# Altium project sion.PrjPcb
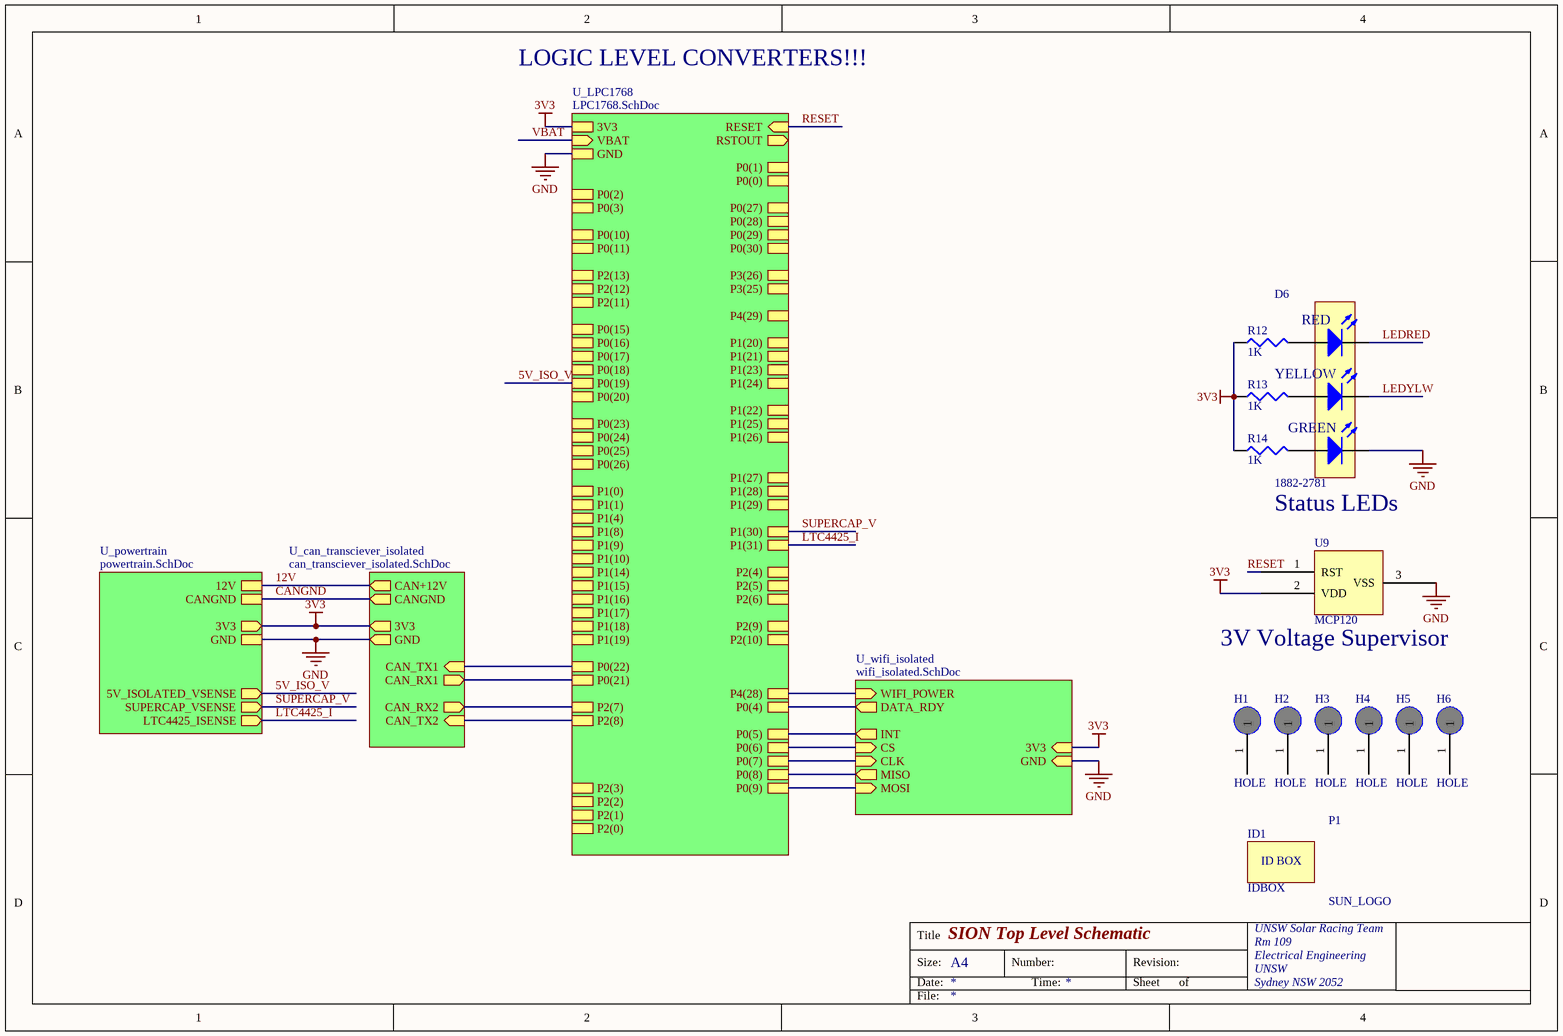
[diagram p0: toplevel.SchDoc]
8 sheets, 172 parts. Net scope: hierarchical (ports join the sheet entries above them; power ports are global).
Board file: sion.PcbDoc
Sheets:
  toplevel.SchDoc
    U_powertrain = powertrain.SchDoc
      U_supercap = supercap.SchDoc
      U_sepic = sepic.SchDoc
    U_can_transciever_isolated = can_transciever_isolated.SchDoc
    U_LPC1768 = LPC1768.SchDoc
  wifi_isolated_uart.SchDoc
  USB_Serial_Isolated.SchDoc

## Sheet toplevel.SchDoc: SION Top Level Schematic
size A4; Organization: UNSW Solar Racing Team; Address3: UNSW; Address4: Sydney NSW 2052; Address2: Electrical Engineering; Address1: Rm 109

### Parts
(Parts that share a designator on the sheet are numbered #1, #2 ... from top to bottom, then left to right.)
D6#1  1882-2781  [LED_TRILEVEL]
H1  HOLE  [#6]
H2  HOLE  [#6]
H3  HOLE  [#6]
H4  HOLE  [#6]
H5  HOLE  [#6]
H6  HOLE  [#6]
ID1  IDBOX  [IDBOX]
P1  SUN_LOGO  [SUNSWIFTLOGO]
R12#1  1K  [0603]
R13#1  1K  [0603]
R14#1  1K  [0603]
U9  MCP120  [SOT23-3]

### Sub-sheets
U_can_transciever_isolated = can_transciever_isolated.SchDoc: CAN+12V (out), CAN_TX1 (in), CAN_TX2 (in), CAN_RX1 (out), CAN_RX2 (out), CANGND (out), GND (out), 3V3 (out)
U_LPC1768 = LPC1768.SchDoc: P0(26), P0(25), P0(24), P0(23), P1(31), P1(30), P0(28), P0(27), P3(26), P3(25), P0(29), P0(30), P1(18), P1(19), P1(20), P1(21), P1(22), P1(24), P1(23), P1(25), P1(26), P1(27), P1(28), P1(29), P0(0), P0(1), P0(10), P0(11), P2(13), P2(12), P2(11), P2(10), P0(22), P0(21), P0(20), P0(19), P0(18), P0(17), P0(15), P0(16), P2(9), P2(8), P2(7), P2(6), P2(5), P2(4), P2(3), P2(2), P2(1), P2(0), P0(2), P0(3), P1(0), P1(1), P1(4), P1(8), P1(9), P1(10), P1(14), P1(15), P1(16), P1(17), P0(4), P0(5), P0(6), P0(7), P0(8), P0(9), P4(29), P4(28), GND, 3V3, RSTOUT (out), RESET (in), VBAT (in)
U_powertrain = powertrain.SchDoc: GND, 5V_ISOLATED_VSENSE (out), SUPERCAP_VSENSE (out), 12V, CANGND, 3V3 (out), LTC4425_ISENSE (out)
U_wifi_isolated = wifi_isolated.SchDoc (file not in this document): CS (in), CLK (in), MISO (out), MOSI (in), INT (out), GND (in), 3V3 (in), WIFI_POWER (in), DATA_RDY (out)

### Nets
3V3: R12#1.1 R13#1.1 R14#1.1 U9.2(VDD) ; sheet U_powertrain/3V3, sheet U_can_transciever_isolated/3V3, sheet U_LPC1768/3V3, sheet U_wifi_isolated/3V3  [project net VDDA]
12V: sheet U_powertrain/12V, sheet U_can_transciever_isolated/CAN+12V
CANGND: sheet U_powertrain/CANGND, sheet U_can_transciever_isolated/CANGND
GND: D6#1.1(K) U9.3(VSS) ; sheet U_powertrain/GND, sheet U_can_transciever_isolated/GND, sheet U_LPC1768/GND, sheet U_wifi_isolated/GND  [project net VREFN]
5V_ISO_V: sheet U_powertrain/5V_ISOLATED_VSENSE, sheet U_LPC1768/P0(19)
LEDRED: D6#1.3(K)
LEDYLW: D6#1.2(K)
LTC4425_I: sheet U_powertrain/LTC4425_ISENSE, sheet U_LPC1768/P1(31)
RESET: U9.1(RST) ; sheet U_LPC1768/RESET
SUPERCAP_V: sheet U_powertrain/SUPERCAP_VSENSE, sheet U_LPC1768/P1(30)
NetD6#1_4: D6#1.4(A) R12#1.2
NetD6#1_5: D6#1.5(A) R13#1.2
NetD6#1_6: D6#1.6(A) R14#1.2
NetTP1_0: sheet U_can_transciever_isolated/CAN_RX1, sheet U_LPC1768/P0(21)
NetTP2_0: sheet U_can_transciever_isolated/CAN_RX2, sheet U_LPC1768/P2(7)
NetTP3_0: sheet U_can_transciever_isolated/CAN_TX1, sheet U_LPC1768/P0(22)
NetTP4_0: sheet U_can_transciever_isolated/CAN_TX2, sheet U_LPC1768/P2(8)
NetU10_76: sheet U_LPC1768/P0(9), sheet U_wifi_isolated/MOSI
NetU10_77: sheet U_LPC1768/P0(8), sheet U_wifi_isolated/MISO
NetU10_78: sheet U_LPC1768/P0(7), sheet U_wifi_isolated/CLK
NetU10_79: sheet U_LPC1768/P0(6), sheet U_wifi_isolated/CS
NetU10_80: sheet U_LPC1768/P0(5), sheet U_wifi_isolated/INT
NetU10_81: sheet U_LPC1768/P0(4), sheet U_wifi_isolated/DATA_RDY
NetU10_82: sheet U_LPC1768/P4(28), sheet U_wifi_isolated/WIFI_POWER

Not connected (* = marked no-connect by the designer): H1 1; H2 1; H3 1; H4 1; H5 1; H6 1

### Notes on the sheet
- LOGIC LEVEL CONVERTERS!!!
- Status LEDs
- (near U9) 3V Voltage Supervisor
- Title
- Size:
- Date:
- A4
- Number:
- Time:
- Revision:
- Sheet
- of
- File:
- (in symbol IDBOX) ID BOX
- (in symbol LED-TRILEVEL) RED; YELLOW; GREEN

### Library data of the parts
D6#1 = LED-TRILEVEL: Three level LED; Farnell: 1461596
H1-H6 = HOLE: Order#: NA; Supplier: NA; Price: NA
R12#1 R13#1 R14#1 = RES1: Resistor; Order#: 9331697; Supplier: Farnell; Price: 0.05
U9 = MCP120T: Voltage Supervisor; Farnell: 1292233; FarnellPrice: 0.951

## Sheet powertrain.SchDoc: SION Power Train
size A4; Organization: UNSW Solar Racing Team; Address3: UNSW; Address4: Sydney NSW 2052; Address2: Electrical Engineering; Address1: Rm 342
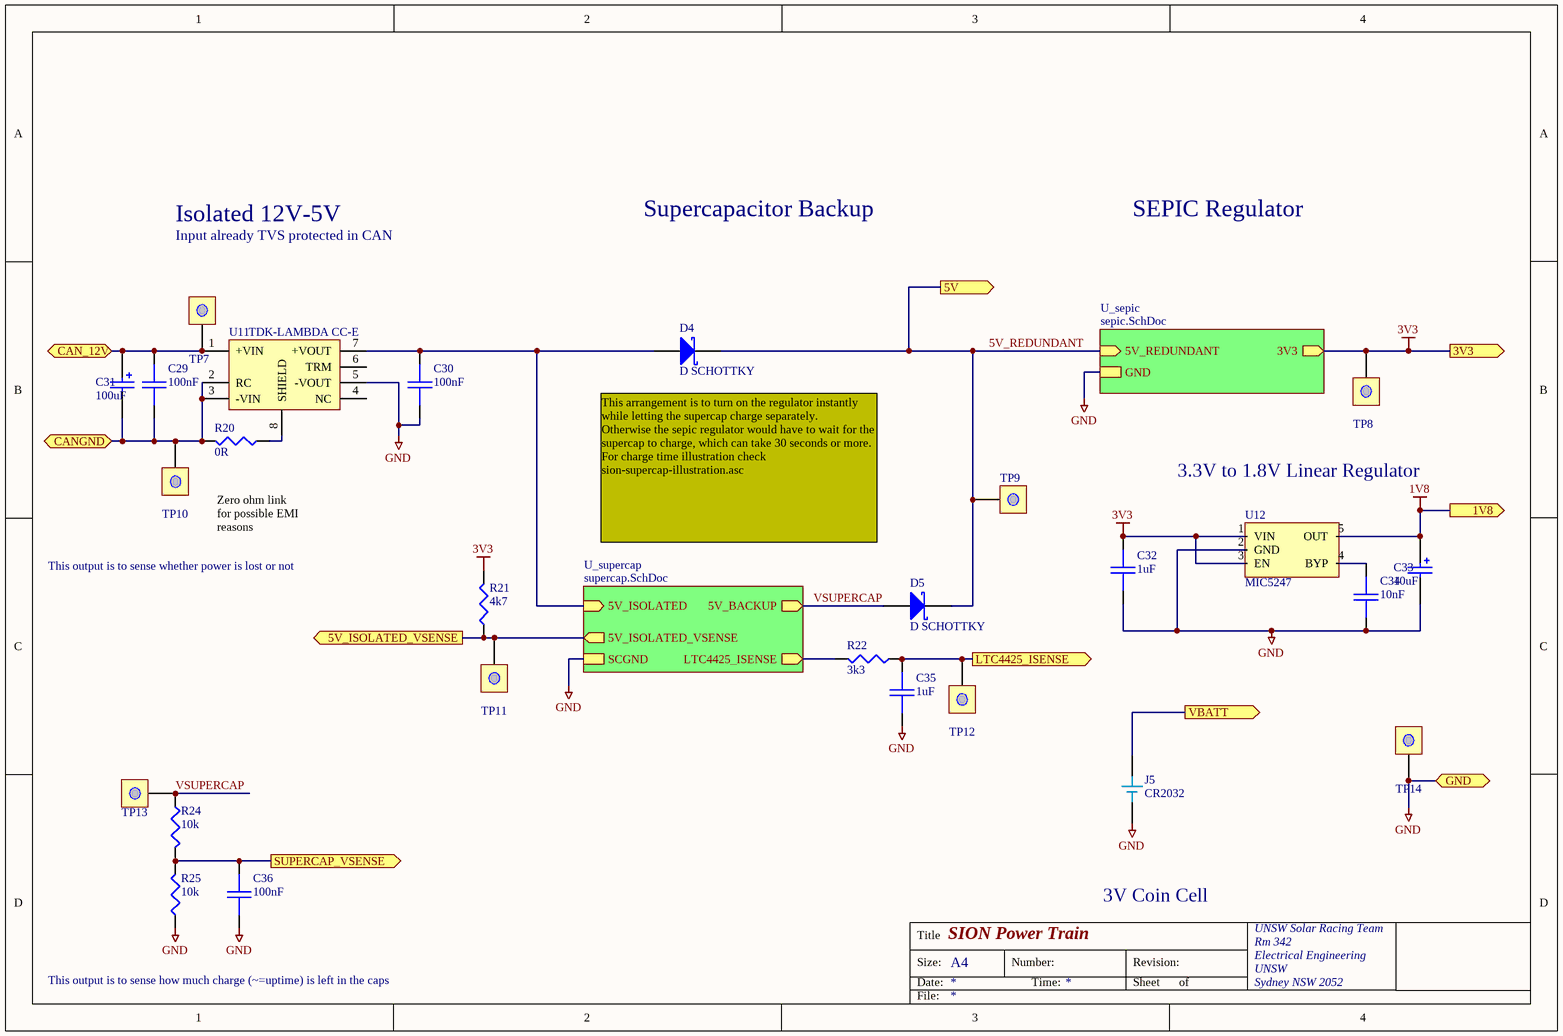
[diagram p1: powertrain.SchDoc]

### Parts
(Parts that share a designator on the sheet are numbered #1, #2 ... from top to bottom, then left to right.)
C29  100nF  [0603]
C30  100nF  [0603]
C31  100uF  [MCCT-CASED]
C32  1uF  [0805]
C33  10uF  [MCCT-CASEA]
C34  10nF  [0603]
C35  1uF  [0805]
C36  100nF  [0603]
D4  D SCHOTTKY  [DIODE-D1.5mm]
D5  D SCHOTTKY  [DIODE-D1.5mm]
J5  CR2032  [CR2032_VERTICAL]
R20  0R  [1206]
R21  4k7  [0603]
R22  3k3  [0603]
R24  10k  [0805]
R25  10k  [0805]
TP7  CAN12V  [TESTPOINT]  (value not drawn)
TP8  3V3  [TESTPOINT]  (value not drawn)
TP9  5V  [TESTPOINT]  (value not drawn)
TP10  CANGND  [TESTPOINT]  (value not drawn)
TP11  VSENSE  [TESTPOINT]  (value not drawn)
TP12  ISENSE  [TESTPOINT]  (value not drawn)
TP13  VCAP  [TESTPOINT]  (value not drawn)
TP14  GND  [TESTPOINT]  (value not drawn)
U11  TDK-LAMBDA CC-E  [CC10-F-E]
U12#1  MIC5247  [SOT23-5]

### Sub-sheets
U_sepic = sepic.SchDoc: 3V3 (out), 5V_REDUNDANT (in), GND
U_supercap = supercap.SchDoc: LTC4425_ISENSE (out), 5V_ISOLATED (in), 5V_BACKUP (out), SCGND, 5V_ISOLATED_VSENSE (out)

### Ports
1V8 (out), 3V3 (out), 5V (out), 5V_ISOLATED_VSENSE (out), CAN_12V, CANGND, GND, LTC4425_ISENSE (out), SUPERCAP_VSENSE (out), VBATT (out)

### Nets
1V8: C33.1 U12#1.5(OUT) ; port 1V8
3V3: C32.1 R21.2 TP8.0(TP) U12#1.1(VIN) U12#1.3(EN) ; port 3V3, sheet U_sepic/3V3  [project net VDDA]
CANGND: C29.2 C31.2 R20.2 TP10.0(TP) U11.2(RC) U11.3(-VIN) ; port CANGND
GND: C30.2 C32.2 C33.2 C34.2 C35.2 C36.2 J5.2 R25.1 TP14.0(TP) U11.5(-VOUT) U12#1.2(GND) ; port GND, sheet U_supercap/SCGND, sheet U_sepic/GND  [project net VREFN]
5V_ISO_V: R21.1 TP11.0(TP) ; port 5V_ISOLATED_VSENSE, sheet U_supercap/5V_ISOLATED_VSENSE
5V_ISOLATED: C30.1 D4.A U11.7(+VOUT) ; sheet U_supercap/5V_ISOLATED
5V_REDUNDANT: D4.K D5.K TP9.0(TP) ; port 5V, sheet U_sepic/5V_REDUNDANT
LTC4425_I: C35.1 R22.1 TP12.0(TP) ; port LTC4425_ISENSE
PROG: R22.2 ; sheet U_supercap/LTC4425_ISENSE
SUPERCAP_V: C36.1 R24.2 R25.2 ; port SUPERCAP_VSENSE
VSUPERCAP: D5.A R24.1 TP13.0(TP) ; sheet U_supercap/5V_BACKUP
NetC29_1: C29.1 C31.1 TP7.0(TP) U11.1(+VIN) ; port CAN_12V
NetC34_1: C34.1 U12#1.4(BYP)
NetJ5_1: J5.1(3V) ; port VBATT
NetR20_1: R20.1 U11.8(SHIELD)

Not connected (* = marked no-connect by the designer): U11 4(NC) 6(TRM)

### Notes on the sheet
- Isolated 12V-5V
- Input already TVS protected in CAN
- Supercapacitor Backup
- SEPIC Regulator
- 3.3V to 1.8V Linear Regulator
- This output is to sense whether power is lost or not
- Zero ohm link
  for possible EMI reasons
- (near D4) This arrangement is to turn on the regulator instantly while letting the supercap charge separately.
  Otherwise the sepic regulator would have to wait for the supercap to charge, which can take 30 seconds or more.
  For charge time illustration check sion-supercap-illustration.asc
- 3V Coin Cell
- This output is to sense how much charge (~=uptime) is left in the caps
- Title
- Size:
- Date:
- A4
- Number:
- Time:
- Revision:
- Sheet
- of
- File:

### Library data of the parts
C29 C30 C32 C34-C36 = CAP: Capacitor
C31 C33 = CAP POL3: Polarized Capacitor (Surface Mount); Revision: July-2002: Re-released for DXP Platform.
  C31: Digikey: 495-2256-1-ND; DigikeyPrice: 1.24; Farnell: 1658601; FarnellPrice: 2.64
  C33: Digikey: 399-3687-1-ND; DigikeyPrice: 0.54; Farnell: 1650980; FarnellPrice: 0.786
D4 D5 = D SCHOTTKY: Schottky Diode; RS: 3954196; Revision: July-2002: Re-released for DXP Platform.; Digikey: 95SQ015-ND; DigikeyPrice: 3.36; Farnell: 506795; FarnellPrice: 8.61
J5 = CR2032: Battery Coin CR2032 3V; Farnell: 1216359; Farnellprice: 3.97
R20-R22 R24 R25 = RES1: Resistor
  R24 R25: Farnell: 1612522; FarnellPrice: 0.022; Digikey: P10.0KCCT-ND; DigikeyPrice: 0.07
TP7-TP14 = TEST: TEST POINT
U11 = CC10-F-E: Isolated DC-DC Converter; Digikey: 445-2435-ND; Farnell: 1547717; FarnellPrice: 56.78; DigikeyPrice: 26.66
U12#1 = MIC5247: 150mA Low-Voltage Linear Regulator; Digikey: 576-1288-1-ND; DigikeyPrice: 1.08

## Sheet supercap.SchDoc: SION Supercapacitor Charger
size A4; Organization: UNSW Solar Racing Team; Address3: UNSW; Address4: Sydney NSW 2052; Address2: Electrical Engineering; Address1: Room 342
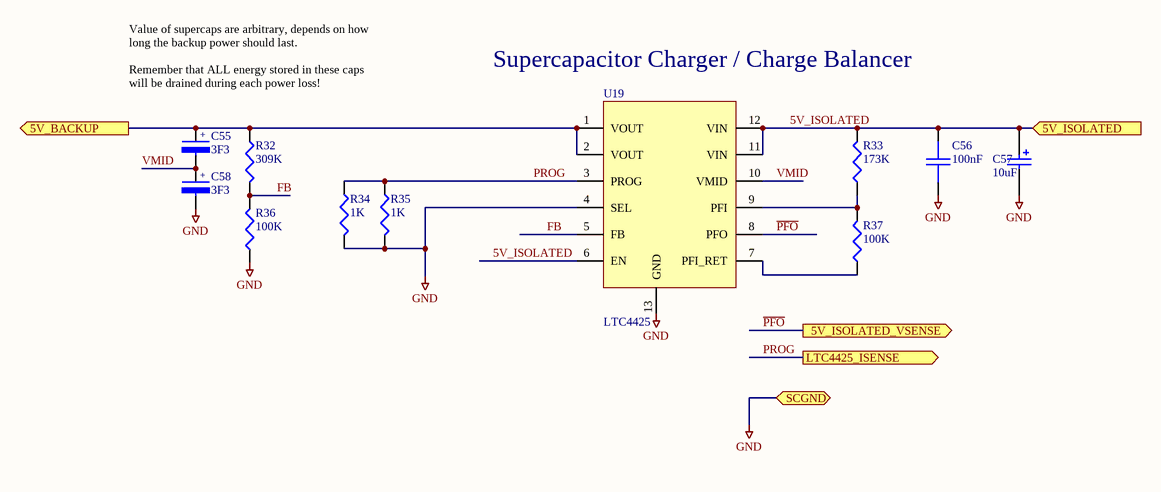
[diagram p2: supercap.SchDoc]

### Parts
(Parts that share a designator on the sheet are numbered #1, #2 ... from top to bottom, then left to right.)
C55  3F3  [ELECTROLYTIC-5-32]
C56  100nF  [0603]
C57  10uF  [MCCT-CASEA]
C58  3F3  [ELECTROLYTIC-5-32]
R32  309K  [0603]
R33#1  173K  [0805]
R34  1K  [0603]
R35  1K  [0603]
R36  100K  [0603]
R37  100K  [0603]
U19  LTC4425  [MS-12]

### Ports
5V_BACKUP (out), 5V_ISOLATED (in), 5V_ISOLATED_VSENSE (out), LTC4425_ISENSE (out), SCGND

### Nets
GND: C56.2 C57.2 C58.2 R34.2 R35.2 R36.1 U19.4(SEL) U19.13(GND) ; port SCGND  [project net VREFN]
5V_ISOLATED: C56.1 C57.1 R33#1.2 U19.6(EN) U19.11(VIN) U19.12(VIN) ; port 5V_ISOLATED
FB: R32.2 R36.2 U19.5(FB)
~{PFO}: U19.8(PFO) ; port 5V_ISOLATED_VSENSE  [project net 5V_ISO_V]
PROG: R34.1 R35.1 U19.3(PROG) ; port LTC4425_ISENSE
VMID: C55.2 C58.1 U19.10(VMID)
VSUPERCAP: C55.1 R32.1 U19.1(VOUT) U19.2(VOUT) ; port 5V_BACKUP
NetR33#1_1: R33#1.1 R37.2 U19.9(PFI)
NetR37_1: R37.1 U19.7(PFI_RET)

### Notes on the sheet
- Supercapacitor Charger / Charge Balancer
- Value of supercaps are arbitrary, depends on how long the backup power should last.
  Remember that ALL energy stored in these caps will be drained during each power loss!
- Title
- Size:
- Date:
- A4
- Number:
- Time:
- Revision:
- Sheet
- of
- File:
- (in symbol CAP-POL) +

### Library data of the parts
C55 C58 = CAP-POL: Supercap; Notes: Nichicon is preferred - higher voltage.; Digikey: 493-3293-ND; Farnell: 1853360; DigikeyPrice: 3.05; FarnellPrice: 4.15
C56 = CAP: Capacitor
C57 = CAP POL3: Polarized Capacitor (Surface Mount); Revision: July-2002: Re-released for DXP Platform.; Digikey: 399-3687-1-ND; DigikeyPrice: 0.54; Farnell: 1650980; FarnellPrice: 0.786
R32 R33#1 R34-R37 = RES1: Resistor
  R32: Farnell: 1797157; Digikey: P309KHCT-ND; DigikeyPrice: 0.04; FarnellPrice: 0.559
  R33#1: FArnell: 1151739; FarnellPrice: 0.157; Digikey: P75.0KHCT-ND; DigikeyPrice: 0.04
  R34 R35: Farnell: 9364366; Digikey: RR08P1.0KDCT-ND; DigikeyPrice: 0.148; FarnellPrice: 0.04
  R36 R37: Farnell: 1344361; FarnellPrice: 0.02; Digikey: CRT0603-BY-1003ELFCT-ND; DigikeyPrice: 0.25
U19 = LTC4425: Supercapacitor Charger; Farnell: 1839114; FarnellPrice: 12.63; Digikey: LTC4425EMSE#PBF-ND; DigikeyPrice: 5.0

## Sheet sepic.SchDoc: SION SEPIC v2 Prototype
size A4; Organization: UNSW Solar Racing Team; Address3: UNSW; Address4: Sydney NSW 2052; Address2: Electrical Engineering; Address1: Room 342
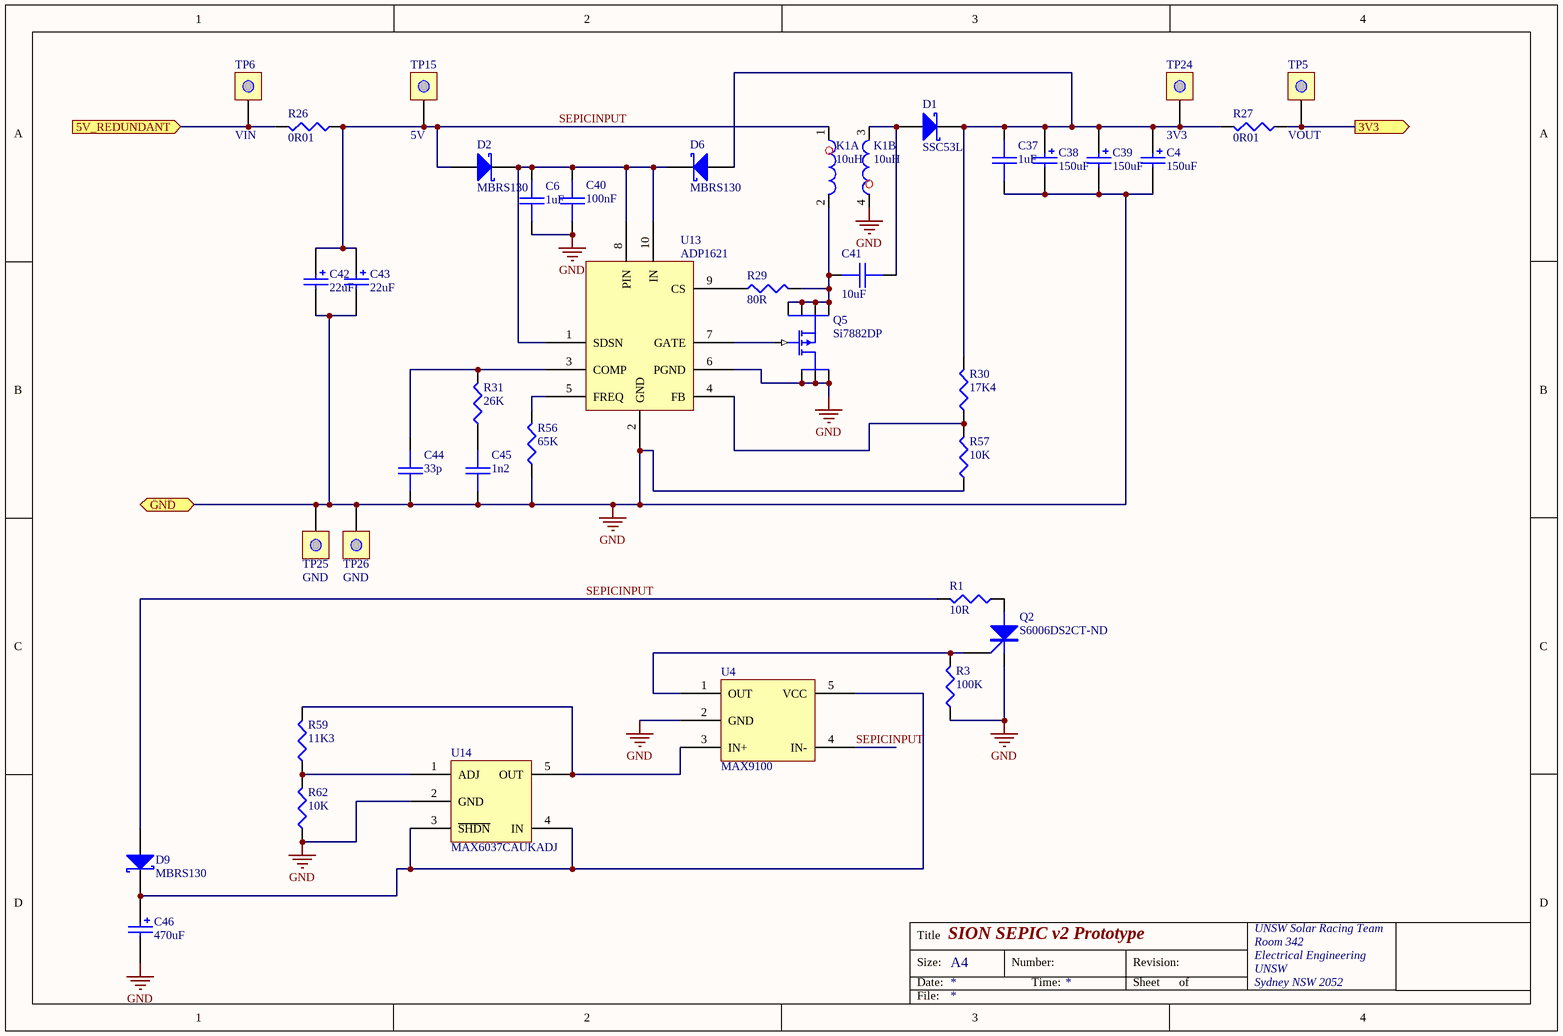
[diagram p3: sepic.SchDoc]

### Parts
(Parts that share a designator on the sheet are numbered #1, #2 ... from top to bottom, then left to right.)
C4#1  150uF  [MCCT-CASED]
C6#1  1uF  [0805]
C37  1uF  [0805]
C38  150uF  [MCCT-CASED]
C39#1  150uF  [MCCT-CASED]
C40#1  100nF  [0603]
C41#1  10uF  [0805]
C42#1  22uF  [MCCT-CASEB]
C43#1  22uF  [MCCT-CASEB]
C44#1  33p  [0603]
C45  1n2  [0603]
C46  470uF  [MCCT-CASED]
D1#1  SSC53L  [SMC]
D2  MBRS130  [SMB]
D6#2  MBRS130  [SMB]
D9  MBRS130  [SMB]
K1  10uH  [CTX2]  (parts A,B of 2)
Q2  S6006DS2CT-ND  [DPAK_N-MOSFET]
Q5#1  Si7882DP  [SO8]
R1#1  10R  [DIODE0.7]
R3  100K  [1206]
R26  0R01  [1206]
R27  0R01  [1206]
R29  80R  [0603]
R30  17K4  [1206]
R31  26K  [1206]
R56#1  65K  [0603]
R57  10K  [1206]
R59  11K3  [1206]
R62#1  10K  [1206]
TP5  VOUT  [TESTPOINT]
TP6  VIN  [TESTPOINT]
TP15  5V  [TESTPOINT]
TP24  3V3  [TESTPOINT]
TP25  GND  [TESTPOINT]
TP26  GND  [TESTPOINT]
U4#1  MAX9100  [SOT23-5]
U13#1  ADP1621  [MSOP10]
U14  MAX6037CAUKADJ  [SOT23-5]

### Ports
3V3 (out), 5V_REDUNDANT (in), GND

### Nets
GND: C4#1.2 C6#1.2 C37.2 C38.2 C39#1.2 C40#1.1 C42#1.2 C43#1.2 C44#1.2 C45.2 C46.2 K1.4 Q2.1(K) Q5#1.1(S) Q5#1.2(S) Q5#1.3(S) R3.1 R56#1.1 R57.1 R62#1.1 TP25.0(TP) TP26.0(TP) U4#1.2(GND) U13#1.2(GND) U13#1.6(PGND) U14.2(GND) ; port GND  [project net VREFN]
VDDA: R27.1 TP5.0(TP) ; port 3V3
5V_REDUNDANT: R26.2 TP6.0(TP) ; port 5V_REDUNDANT
SEPICINPUT: C42#1.1 C43#1.1 D2.A D9.A K1.1 R1#1.2 R26.1 TP15.0(TP) U4#1.4(IN-)
NetC4#1_1: C4#1.1 C37.1 C38.1 C39#1.1 D1#1.K D6#2.A R27.2 R30.2 TP24.0(TP)
NetC6#1_1: C6#1.1 C40#1.2 D2.K D6#2.K U13#1.1(SDSN) U13#1.8(PIN) U13#1.10(IN)
NetC41#1_1: C41#1.1 K1.2 Q5#1.5(D) Q5#1.6(D) Q5#1.7(D) Q5#1.8(D) R29.2
NetC41#1_2: C41#1.2 D1#1.A K1.3
NetC44#1_1: C44#1.1 R31.2 U13#1.3(COMP)
NetC45_1: C45.1 R31.1
NetC46_1: C46.1 D9.K U4#1.5(VCC) U14.3(~{SHDN}) U14.4(IN)
NetQ2_2: Q2.2(A) R1#1.1
NetQ2_3: Q2.3(G) R3.2 U4#1.1(OUT)
NetQ5#1_4: Q5#1.4(G) U13#1.7(GATE)
NetR29_1: R29.1 U13#1.9(CS)
NetR30_1: R30.1 R57.2 U13#1.4(FB)
NetR56#1_2: R56#1.2 U13#1.5(FREQ)
NetR59_1: R59.1 R62#1.2 U14.1(ADJ)
NetR59_2: R59.2 U4#1.3(IN+) U14.5(OUT)

### Notes on the sheet
- Title
- Size:
- Date:
- A4
- Number:
- Time:
- Revision:
- Sheet
- of
- File:

### Library data of the parts
C4#1 C38 C39#1 C42#1 C43#1 C46 = CAP POL3: Polarized Capacitor (Surface Mount); Manufacturer: Generic Components; Class I: Passive; Value: 100pF; Published: 8-Jun-2000; Revision: July-2002: Re-released for DXP Platform.; Publisher: Altium Limited; Class II: Capacitor
  C4#1 C38 C39#1: Farnell: 1754096; FarnellPrice: 2.97
  C42#1 C43#1: Farnell: 1457447; FarnellPrice: 1.06
  C46: Digikey: 718-1780-1-ND
C6#1 C37 C40#1 C44#1 C45 = CAP: Capacitor
  C6#1 C37: Farnell: 1683651; FarnellPrice: 0.05
  C44#1: Farnell: 1816801; FarnellPrice: 0.05
  C45: Farnell: 3019664; FarnellPrice: 0.167
C41#1 = CAP: grm21br61a106k; Farnell: 1828805; FarnellPrice: 0.448
D1#1 D2 D6#2 D9 = D SCHOTTKY: Schottky Diode; Manufacturer: Generic Components; Class I: Discrete; Class II: Diode - Schottky; Published: 8-Jun-2000; Revision: July-2002: Re-released for DXP Platform.; Publisher: Altium Limited
  D1#1: Farnell: 1336558; FarnellPrice: 2.64
  D2 D6#2 D9: Farnell: 9556931; FarnellPrice: 0.43
K1 = CTX10-2-R: Coupled Power Inductor; Farnell: 1194198; Price: 8.53
Q2 = SCR: Sensitive SCR; Digikey: S6006DS2CT-ND
Q5#1 = Si7882DP: Power N mosfet; Farnell: 1470159; FarnellPrice: 5.15
R1#1 R3 R26 R27 R29-R31 R56#1 R57 R59 R62#1 = RES1: Resistor
  R1#1: Farnell: 1357872; FarnellPrice: 0.119
  R3 R57: Farnell: 1469669; FarnellPrice: 0.02
  R26 R27: Farnell: 8067520; FarnellPrice: 0.616
  R29: Farnell: 1644187; FarnellPrice: 0.075
  R30: Farnell: 1152720; FarnellPrice: 0.02
  R31: Farnell: 1152861; FarnellPrice: 0.02
  R56#1: Farnell: 1633712; FarnellPrice: 0.01
  R59: Digikey: RNCF1206BKC11K3CT-ND
  R62#1: Digikey: CRT1206-BY-1002ELFCT-ND
TP5 TP6 TP15 TP24-TP26 = TEST: TEST POINT
U4#1 = MAX9100EUK: Micropower comparator; Digikey: MAX9100EUK+TCT-ND
U13#1 = ADP1621: SEPIC / Boost Controller; Digikey: ADP1621ARMZ-R7CT-ND; DigikeyPrice: 2.97; Farnell: 1461500; FarnellPrice: 5.27
U14 = MAX6037CAUKADJ: Adjustable voltage reference; Digikey: MAX6037CAUKADJ+TCT-ND; DigikeyPrice: 2.05

## Sheet can_transciever_isolated.SchDoc: Dual Isolated CAN transciever
size A4; Organization: UNSW Solar Racing Team; Address3: UNSW; Address4: Sydney NSW 2052; Address2: Electrical Engineering; Address1: Rm 109
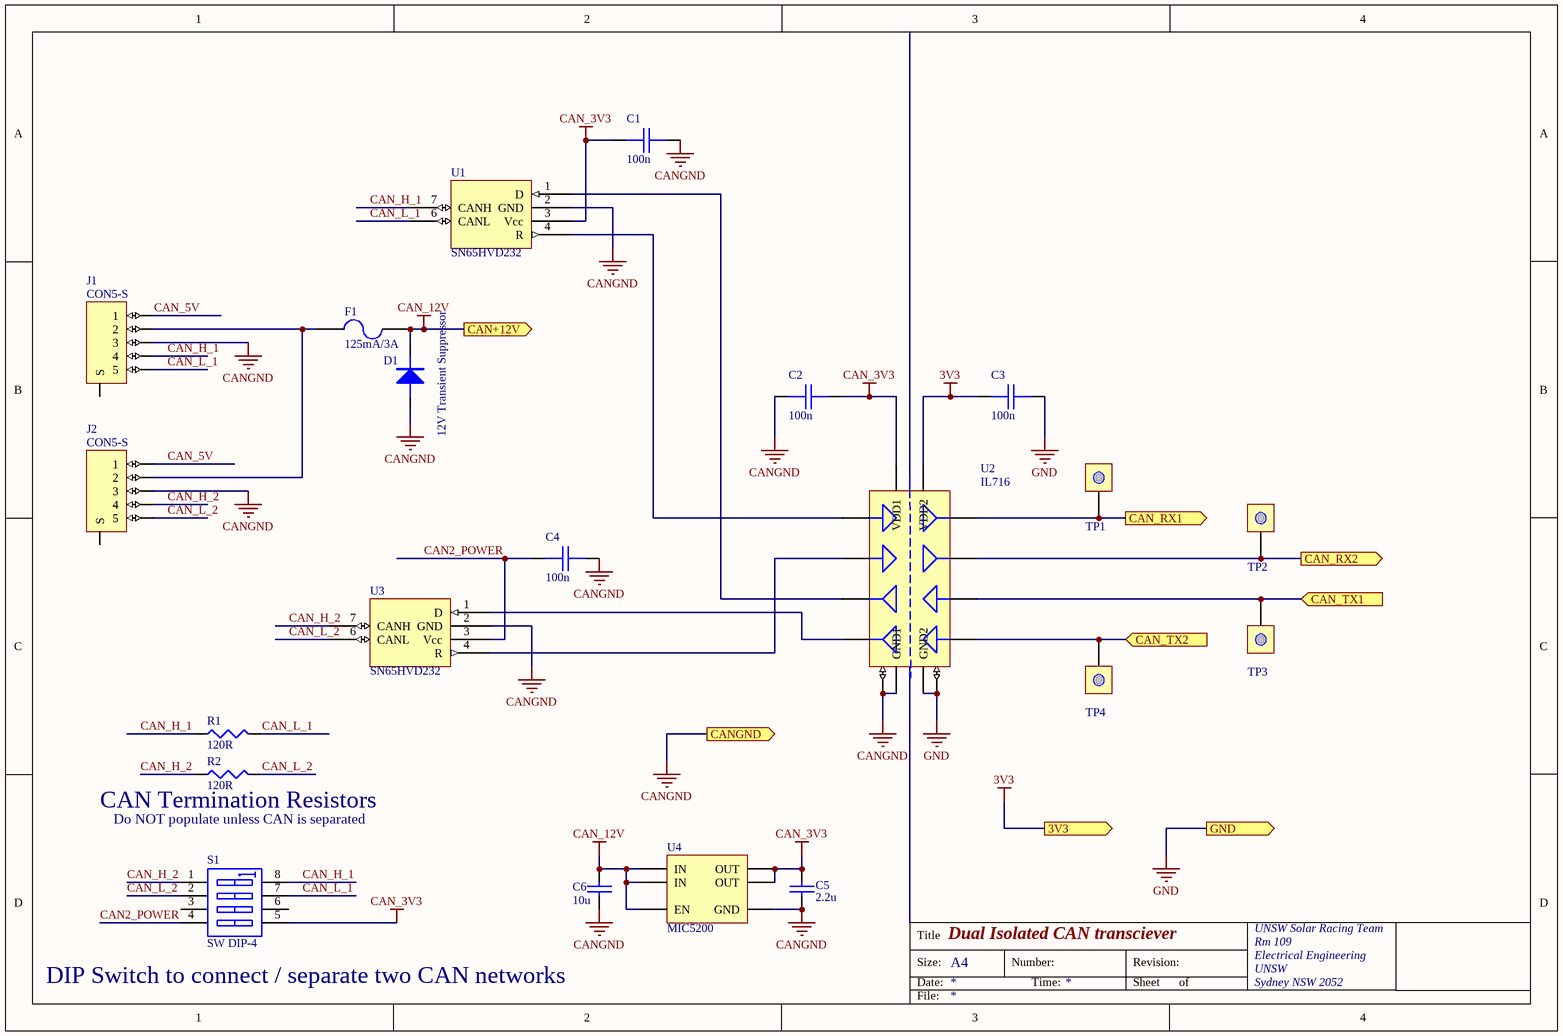
[diagram p4: can_transciever_isolated.SchDoc]

### Parts
(Parts that share a designator on the sheet are numbered #1, #2 ... from top to bottom, then left to right.)
C1  100n  [0603]
C2  100n  [0603]
C3  100n  [0603]
C4#2  100n  [0603]
C5  2.2u  [MCCT-CASEA]
C6#2  10u  [MCCT-CASEB]
D1#2  12V Transient Suppressor  [SMA]
F1  125mA/3A  [LITTELFUSE-154]
J1  CON5-S  [TRIAD5F]
J2  CON5-S  [TRIAD5F]
R1#2  120R  [0603]
R2  120R  [0603]
S1  SW DIP-4  [DIP8]
TP1  TEST  [TESTPOINT]  (value not drawn)
TP2  TEST  [TESTPOINT]  (value not drawn)
TP3  TEST  [TESTPOINT]  (value not drawn)
TP4  TEST  [TESTPOINT]  (value not drawn)
U1  SN65HVD232  [SO8]
U2  IL716  [SO16]
U3  SN65HVD232  [SO8]
U4#2  MIC5200  [SO8]

### Ports
3V3 (out), CAN+12V (out), CAN_RX1 (out), CAN_RX2 (out), CAN_TX1 (in), CAN_TX2 (in), CANGND (out), GND (out)

### Nets
3V3: C3.2 U2.16(VDD2) ; port 3V3  [project net VDDA]
CAN_3V3: C1.2 C2.2 C5.2 S1.5(B4) U1.3(Vcc) U2.1(VDD1) U4#2.1(OUT) U4#2.2(OUT)
CAN_12V: C6#2.1 D1#2.K F1.2 U4#2.5(EN) U4#2.7(IN) U4#2.8(IN) ; port CAN+12V  [project net 12V]
CANGND: C1.1 C2.1 C4#2.1 C5.1 C6#2.2 D1#2.A J1.3 J2.3 U1.2(GND) U2.2(GND1) U2.8(GND1) U3.2(GND) U4#2.4(GND) ; port CANGND
GND: C3.1 U2.9(GND2) U2.15(GND2) ; port GND  [project net VREFN]
CAN2_POWER: C4#2.2 S1.4(A4) U3.3(Vcc)
CAN_5V: J1.1 J2.1
CAN_H_1: J1.4 R1#2.1 S1.8(B1) U1.7(CANH)
CAN_H_2: J2.4 R2.1 S1.1(A1) U3.7(CANH)
CAN_L_1: J1.5 R1#2.2 S1.7(B2) U1.6(CANL)
CAN_L_2: J2.5 R2.2 S1.2(A2) U3.6(CANL)
NetF1_1: F1.1 J1.2 J2.2
NetTP1_0: TP1.0(TP) U2.14(OUT1) ; port CAN_RX1
NetTP2_0: TP2.0(TP) U2.13(OUT2) ; port CAN_RX2
NetTP3_0: TP3.0(TP) U2.12(OUT3) ; port CAN_TX1
NetTP4_0: TP4.0(TP) U2.11(IN4) ; port CAN_TX2
NetU1_1: U1.1(D) U2.5(IN3)
NetU1_4: U1.4(R) U2.3(IN1)
NetU2_4: U2.4(IN2) U3.4(R)
NetU2_6: U2.6(OUT4) U3.1(D)

Not connected (* = marked no-connect by the designer): J1 0(S); J2 0(S); S1 3(A3) 6(B3)

### Notes on the sheet
- (near R2) CAN Termination Resistors
- Do NOT populate unless CAN is separated
- DIP Switch to connect / separate two CAN networks
- Title
- Size:
- Date:
- A4
- Number:
- Time:
- Revision:
- Sheet
- of
- File:

### Library data of the parts
C1 C4#2 = CAP: Capacitor; something: 0.31; Note: Purchase a reel.; Farnell: 753-567; Price: 0.30
C2 C3 = CAP: Capacitor; something: 0.31; note: Purchase a reel.; Farnell: 753-567; Price: 0.30
C5 = CAP: Capacitor; Something: 0.938; Farnell: 967-099; Supplier: Farnell.; Price: 0.938
C6#2 = CAP: Capacitor; Farnell: 967-117; Price: 1.45
D1#2 = DIODE: Farnell: 9802754; FarnellPrice: 1.20; Digikey: 497-6503-1-ND; DigikeyPrice: 0.56
F1 = FUSE2: Fuse; Farnell: 154-375T (Holder + 125mA fuse) AND 0454 003 (3A Fuse); Price: 4.00
J1 J2 = CON5-S: Connector, 2 pin, with shield @ S; Farnell: 131-040; Price: 16.79
R1#2 R2 = RES1: Resistor
S1 = SW DIP-4: DIP Switch, 4 Position, SPST; Published: 24-Mar-1999; LatestRevisionDate: 17-Jul-2002; LatestRevisionNote: Re-released for DXP Platform.; PackageReference: SO8; Publisher: Altium Limited; Code_JEDEC: MS-012-AA; Code_IPC: SO8; Farnell: 9901680; FarnellPrice: 5.28
TP1-TP4 = TEST: TEST POINT
U1 U3 = SN65HVD232: 3.3V CAN Transciever; Part Field 2: 5.00; Part Field 3: www.ti.com - Texas Instruments; Farnell: NA
U2 = IL716: 2Tx 2Rx Digital Isolator; Farnell: 9570640; FarnellPrice: 24.61; Digikey: 390-1065-5-ND; DigikeyPrice: 7.70
U4#2 = MIC5200: MIC5200 - SO8; Part Field 2: 2.00; Part Field 3: Computer Science and Engineering; Part Field 4: David Johnson; Farnell: 572-111; Price: 10.72

## Sheet LPC1768.SchDoc: LPC1768
size A4; Organization: UNSW Solar Racing Team; Address3: UNSW; Address4: Sydney NSW 2052; Address2: Electrical Engineering; Address1: Room 342
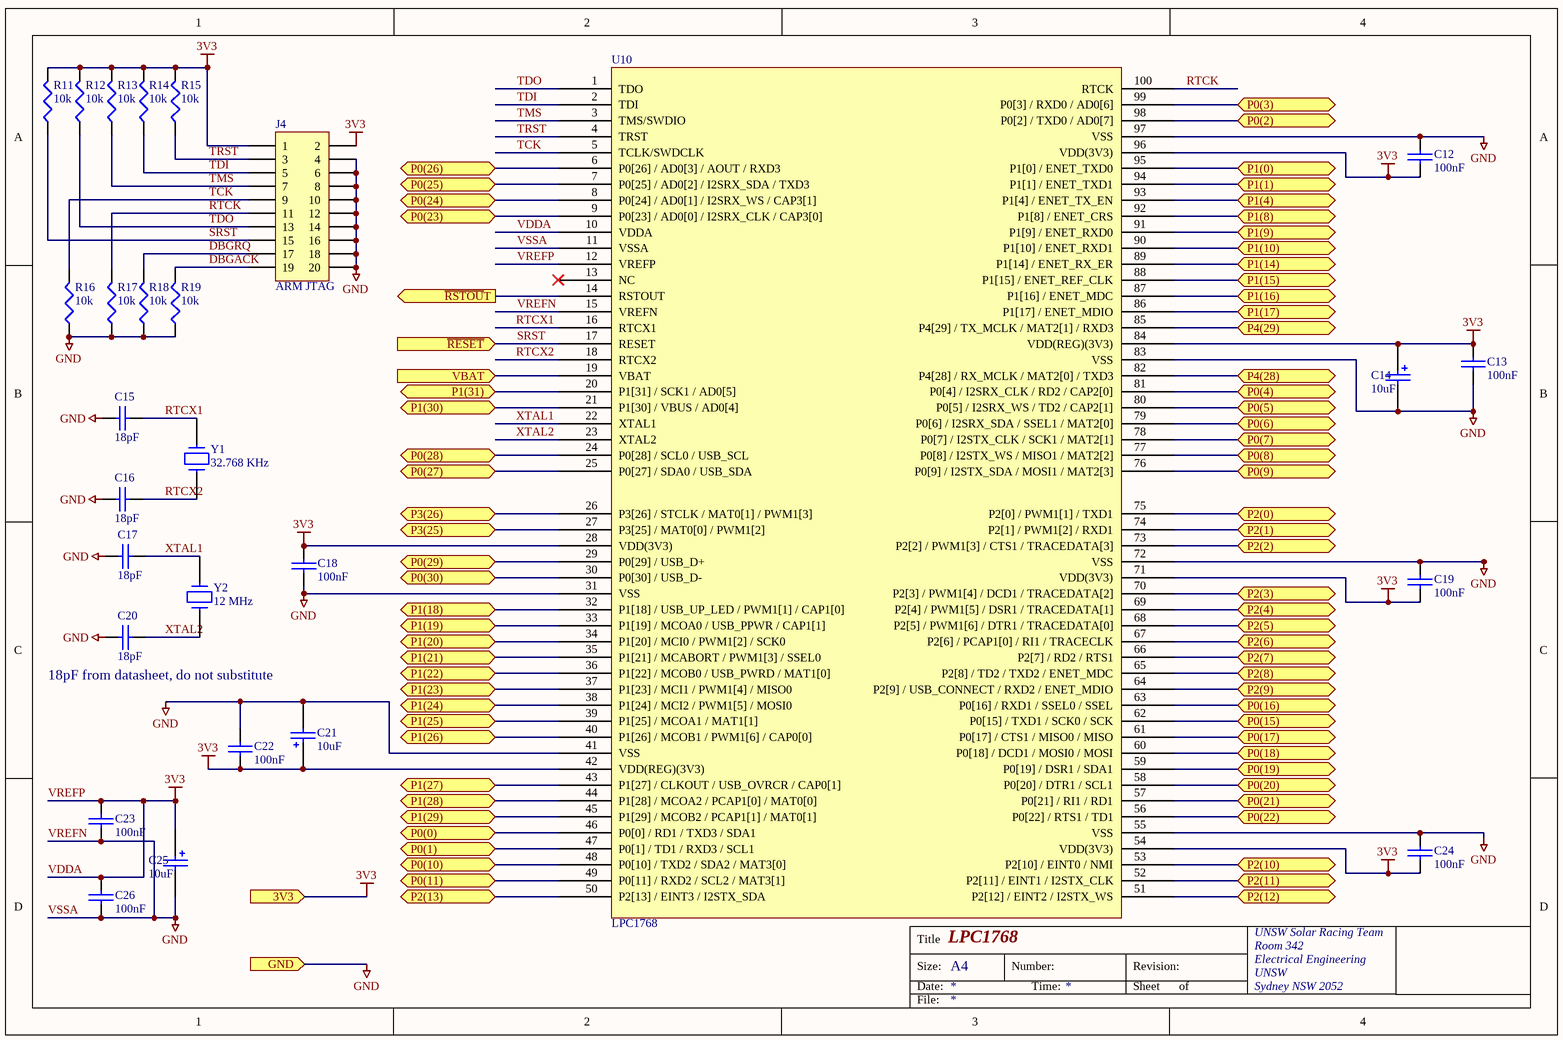
[diagram p5: LPC1768.SchDoc]

### Parts
(Parts that share a designator on the sheet are numbered #1, #2 ... from top to bottom, then left to right.)
C12  100nF  [0603]
C13  100nF  [0603]
C14  10uF  [MCCT-CASEA]
C15  18pF  [0603]
C16  18pF  [0603]
C17  18pF  [0603]
C18  100nF  [0603]
C19  100nF  [0603]
C20  18pF  [0603]
C21  10uF  [MCCT-CASEA]
C22  100nF  [0603]
C23  100nF  [0603]
C24  100nF  [0603]
C25  10uF  [MCCT-CASEA]
C26  100nF  [0603]
J4  ARM JTAG  [HDR2X10]
R11  10k  [0603]
R12#2  10k  [0603]
R13#2  10k  [0603]
R14#2  10k  [0603]
R15  10k  [0603]
R16  10k  [0603]
R17  10k  [0603]
R18  10k  [0603]
R19  10k  [0603]
U10  LPC1768  [QFP100]
Y1  32.768 KHz  [WATCHA]
Y2  12 MHz  [HC49/4H]

### Ports
3V3, GND, P0(0), P0(1), P0(2), P0(3), P0(4), P0(5), P0(6), P0(7), P0(8), P0(9), P0(10), P0(11), P0(15), P0(16), P0(17), P0(18), P0(19), P0(20), P0(21), P0(22), P0(23), P0(24), P0(25), P0(26), P0(27), P0(28), P0(29), P0(30), P1(0), P1(1), P1(4), P1(8), P1(9), P1(10), P1(14), P1(15), P1(16), P1(17), P1(18), P1(19), P1(20), P1(21), P1(22), P1(23), P1(24), P1(25), P1(26), P1(27), P1(28), P1(29), P1(30), P1(31), P2(0), P2(1), P2(2), P2(3), P2(4), P2(5), P2(6), P2(7), P2(8), P2(9), P2(10), P2(11), P2(12), P2(13), P3(25), P3(26), P4(28), P4(29), VBAT (in), ~{RESET} (in), ~{RSTOU}T (out)

### Nets
VDDA: C12.2 C13.1 C14.1 C18.1 C19.2 C21.1 C22.2 C23.1 C24.2 C25.1 C26.1 J4.1 J4.2 R11.2 R12#2.2 R13#2.2 R14#2.2 R15.2 U10.10(VDDA) U10.12(VREFP) U10.28(VDD(3V3)) U10.42(VDD(REG)(3V3)) U10.54(VDD(3V3)) U10.71(VDD(3V3)) U10.84(VDD(REG)(3V3)) U10.96(VDD(3V3)) ; port 3V3  [also labelled 3V3, VREFP]
VREFN: C12.1 C13.2 C14.2 C15.2 C16.2 C17.2 C18.2 C19.1 C20.2 C21.2 C22.1 C23.2 C24.1 C25.2 C26.2 J4.4 J4.6 J4.8 J4.10 J4.12 J4.14 J4.16 J4.18 J4.20 R16.1 R17.1 R18.1 R19.1 U10.11(VSSA) U10.15(VREFN) U10.31(VSS) U10.41(VSS) U10.55(VSS) U10.72(VSS) U10.83(VSS) U10.97(VSS) ; port GND  [also labelled GND, VSSA]
5V_ISO_V: U10.59(P0[19]_/_DSR1_/_SDA1) ; port P0(19)
DBGACK: J4.19 R19.2
DBGRQ: J4.17 R18.2
LTC4425_I: U10.20(P1[31]_/_SCK1_/_AD0[5]) ; port P1(31)
RTCK: J4.11 R17.2 U10.100(RTCK)
RTCX1: C15.1 U10.16(RTCX1) Y1.2
RTCX2: C16.1 U10.18(RTCX2) Y1.1
SRST: J4.15 R11.1 U10.17(RESET) ; port ~{RESET}
SUPERCAP_V: U10.21(P1[30]_/_VBUS_/_AD0[4]) ; port P1(30)
TCK: J4.9 R16.2 U10.5(TCLK/SWDCLK)
TDI: J4.5 R14#2.1 U10.2(TDI)
TDO: J4.13 R12#2.1 U10.1(TDO)
TMS: J4.7 R13#2.1 U10.3(TMS/SWDIO)
TRST: J4.3 R15.1 U10.4(TRST)
VBAT: U10.19(VBAT) ; port VBAT
XTAL1: C17.1 U10.22(XTAL1) Y2.1
XTAL2: C20.1 U10.23(XTAL2) Y2.2
NetTP1_0: U10.57(P0[21]_/_RI1_/_RD1) ; port P0(21)
NetTP2_0: U10.66(P2[7]_/_RD2_/_RTS1) ; port P2(7)
NetTP3_0: U10.56(P0[22]_/_RTS1_/_TD1) ; port P0(22)
NetTP4_0: U10.65(P2[8]_/_TD2_/_TXD2_/_ENET_MDC) ; port P2(8)
NetU10_6: U10.6(P0[26]_/_AD0[3]_/_AOUT_/_RXD3) ; port P0(26)
NetU10_7: U10.7(P0[25]_/_AD0[2]_/_I2SRX_SDA_/_TXD3) ; port P0(25)
NetU10_8: U10.8(P0[24]_/_AD0[1]_/_I2SRX_WS_/_CAP3[1]) ; port P0(24)
NetU10_9: U10.9(P0[23]_/_AD0[0]_/_I2SRX_CLK_/_CAP3[0]) ; port P0(23)
NetU10_14: U10.14(RSTOUT) ; port ~{RSTOU}T
NetU10_24: U10.24(P0[28]_/_SCL0_/_USB_SCL) ; port P0(28)
NetU10_25: U10.25(P0[27]_/_SDA0_/_USB_SDA) ; port P0(27)
NetU10_26: U10.26(P3[26]_/_STCLK_/_MAT0[1]_/_PWM1[3]) ; port P3(26)
NetU10_27: U10.27(P3[25]_/_MAT0[0]_/_PWM1[2]) ; port P3(25)
NetU10_29: U10.29(P0[29]_/_USB_D+) ; port P0(29)
NetU10_30: U10.30(P0[30]_/_USB_D-) ; port P0(30)
NetU10_32: U10.32(P1[18]_/_USB_UP_LED_/_PWM1[1]_/_CAP1[0]) ; port P1(18)
NetU10_33: U10.33(P1[19]_/_MCOA0_/_USB_PPWR_/_CAP1[1]) ; port P1(19)
NetU10_34: U10.34(P1[20]_/_MCI0_/_PWM1[2]_/_SCK0) ; port P1(20)
NetU10_35: U10.35(P1[21]_/_MCABORT_/_PWM1[3]_/_SSEL0) ; port P1(21)
NetU10_36: U10.36(P1[22]_/_MCOB0_/_USB_PWRD_/_MAT1[0]) ; port P1(22)
NetU10_37: U10.37(P1[23]_/_MCI1_/_PWM1[4]_/_MISO0) ; port P1(23)
NetU10_38: U10.38(P1[24]_/_MCI2_/_PWM1[5]_/_MOSI0) ; port P1(24)
NetU10_39: U10.39(P1[25]_/_MCOA1_/_MAT1[1]) ; port P1(25)
NetU10_40: U10.40(P1[26]_/_MCOB1_/_PWM1[6]_/_CAP0[0]) ; port P1(26)
NetU10_43: U10.43(P1[27]_/_CLKOUT_/_USB_OVRCR_/_CAP0[1]) ; port P1(27)
NetU10_44: U10.44(P1[28]_/_MCOA2_/_PCAP1[0]_/_MAT0[0]) ; port P1(28)
NetU10_45: U10.45(P1[29]_/_MCOB2_/_PCAP1[1]_/_MAT0[1]) ; port P1(29)
NetU10_46: U10.46(P0[0]_/_RD1_/_TXD3_/_SDA1) ; port P0(0)
NetU10_47: U10.47(P0[1]_/_TD1_/_RXD3_/_SCL1) ; port P0(1)
NetU10_48: U10.48(P0[10]_/_TXD2_/_SDA2_/_MAT3[0]) ; port P0(10)
NetU10_49: U10.49(P0[11]_/_RXD2_/_SCL2_/_MAT3[1]) ; port P0(11)
NetU10_50: U10.50(P2[13]_/_EINT3_/_I2STX_SDA) ; port P2(13)
NetU10_51: U10.51(P2[12]_/_EINT2_/_I2STX_WS) ; port P2(12)
NetU10_52: U10.52(P2[11]_/_EINT1_/_I2STX_CLK) ; port P2(11)
NetU10_53: U10.53(P2[10]_/_EINT0_/_NMI) ; port P2(10)
NetU10_58: U10.58(P0[20]_/_DTR1_/_SCL1) ; port P0(20)
NetU10_60: U10.60(P0[18]_/_DCD1_/_MOSI0_/_MOSI) ; port P0(18)
NetU10_61: U10.61(P0[17]_/_CTS1_/_MISO0_/_MISO) ; port P0(17)
NetU10_62: U10.62(P0[15]_/_TXD1_/_SCK0_/_SCK) ; port P0(15)
NetU10_63: U10.63(P0[16]_/_RXD1_/_SSEL0_/_SSEL) ; port P0(16)
NetU10_64: U10.64(P2[9]_/_USB_CONNECT_/_RXD2_/_ENET_MDIO) ; port P2(9)
NetU10_67: U10.67(P2[6]_/_PCAP1[0]_/_RI1_/_TRACECLK) ; port P2(6)
NetU10_68: U10.68(P2[5]_/_PWM1[6]_/_DTR1_/_TRACEDATA[0]) ; port P2(5)
NetU10_69: U10.69(P2[4]_/_PWM1[5]_/_DSR1_/_TRACEDATA[1]) ; port P2(4)
NetU10_70: U10.70(P2[3]_/_PWM1[4]_/_DCD1_/_TRACEDATA[2]) ; port P2(3)
NetU10_73: U10.73(P2[2]_/_PWM1[3]_/_CTS1_/_TRACEDATA[3]) ; port P2(2)
NetU10_74: U10.74(P2[1]_/_PWM1[2]_/_RXD1) ; port P2(1)
NetU10_75: U10.75(P2[0]_/_PWM1[1]_/_TXD1) ; port P2(0)
NetU10_76: U10.76(P0[9]_/_I2STX_SDA_/_MOSI1_/_MAT2[3]) ; port P0(9)
NetU10_77: U10.77(P0[8]_/_I2STX_WS_/_MISO1_/_MAT2[2]) ; port P0(8)
NetU10_78: U10.78(P0[7]_/_I2STX_CLK_/_SCK1_/_MAT2[1]) ; port P0(7)
NetU10_79: U10.79(P0[6]_/_I2SRX_SDA_/_SSEL1_/_MAT2[0]) ; port P0(6)
NetU10_80: U10.80(P0[5]_/_I2SRX_WS_/_TD2_/_CAP2[1]) ; port P0(5)
NetU10_81: U10.81(P0[4]_/_I2SRX_CLK_/_RD2_/_CAP2[0]) ; port P0(4)
NetU10_82: U10.82(P4[28]_/_RX_MCLK_/_MAT2[0]_/_TXD3) ; port P4(28)
NetU10_85: U10.85(P4[29]_/_TX_MCLK_/_MAT2[1]_/_RXD3) ; port P4(29)
NetU10_86: U10.86(P1[17]_/_ENET_MDIO) ; port P1(17)
NetU10_87: U10.87(P1[16]_/_ENET_MDC) ; port P1(16)
NetU10_88: U10.88(P1[15]_/_ENET_REF_CLK) ; port P1(15)
NetU10_89: U10.89(P1[14]_/_ENET_RX_ER) ; port P1(14)
NetU10_90: U10.90(P1[10]_/_ENET_RXD1) ; port P1(10)
NetU10_91: U10.91(P1[9]_/_ENET_RXD0) ; port P1(9)
NetU10_92: U10.92(P1[8]_/_ENET_CRS) ; port P1(8)
NetU10_93: U10.93(P1[4]_/_ENET_TX_EN) ; port P1(4)
NetU10_94: U10.94(P1[1]_/_ENET_TXD1) ; port P1(1)
NetU10_95: U10.95(P1[0]_/_ENET_TXD0) ; port P1(0)
NetU10_98: U10.98(P0[2]_/_TXD0_/_AD0[7]) ; port P0(2)
NetU10_99: U10.99(P0[3]_/_RXD0_/_AD0[6]) ; port P0(3)

Not connected (* = marked no-connect by the designer): U10 13(NC)*

### Notes on the sheet
- 18pF from datasheet, do not substitute
- Title
- Size:
- Date:
- A4
- Number:
- Time:
- Revision:
- Sheet
- of
- File:

### Library data of the parts
C12 C13 C18 C19 C22-C24 C26 = CAP: Capacitor; Farnell: 753-567; Price: 0.30
C14 C21 C25 = CAP POL3: Polarized Capacitor (Surface Mount); Revision: July-2002: Re-released for DXP Platform.; Digikey: 399-3687-1-ND; DigikeyPrice: 0.54; Farnell: 1650980; FarnellPrice: 0.786
C15-C17 C20 = CAP: Capacitor; Order#: 721-992; Price: 0.11; Supplier: Farnell
J4 = Header 10X2: Header, 10-Pin, Dual row; Farnell: 9733647; FarnellPrice: 3.38; Digikey: WM8146-ND; DigikeyPrice: 3.39
R11 R12#2 R13#2 R14#2 R15-R19 = RES1: Resistor
U10 = LPC1768: NXP Cortex-M3 Microcontroller, 100pin 100MHz; Farnell: 1718549; FarnellPrice: 18.94; Digikey: 568-4796-ND; DigikeyPrice: 11.44
Y1 Y2 = CRYSTAL
  Y1: Farnell: 1611828; FarnellPrice: 0.401; Digikey: 535-9032-ND; DigikeyPrice: 0.25
  Y2: Farnell: 7940142; FarnellPrice: 0.854; DigikeyPrice: 0.46; Digikey: 887-1013-ND

## Sheet wifi_isolated_uart.SchDoc: Isolated_Wifi
size A4; Organization: UNSW Solar Racing Team; Address3: UNSW; Address4: Sydney NSW 2052; Address2: Electrical Engineering; Address1: Room 342
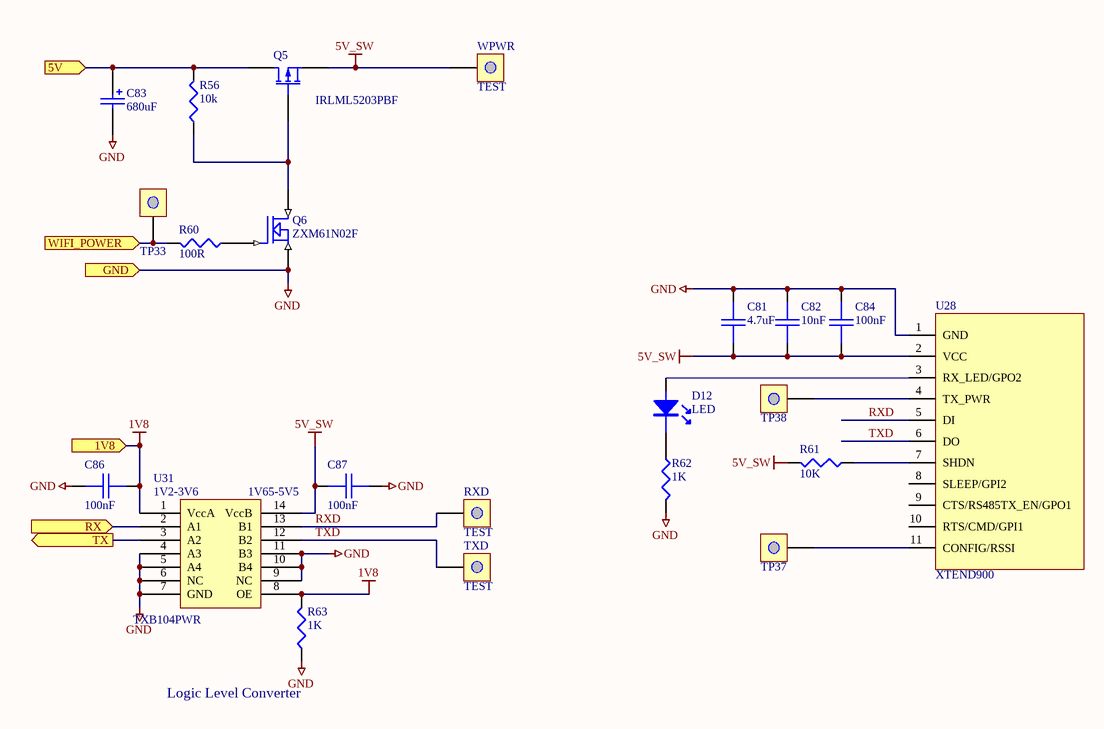
[diagram p6: wifi_isolated_uart.SchDoc]

### Parts
(Parts that share a designator on the sheet are numbered #1, #2 ... from top to bottom, then left to right.)
C81  4.7uF  [0603]
C82  10nF  [0603]
C83  680uF  [MCCT-CASED]
C84  100nF  [0603]
C86  100nF  [0603]
C87  100nF  [0603]
D12  LED  [0805LED]
Q5#2  IRLML5203PBF  [SOT23-3]
Q6  ZXM61N02F  [SOT23-3]
R56#2  10k  [0603]
R60  100R  [0603]
R61  10K  [0603]
R62#2  1K  [0603]
R63  1K  [0603]
RXD  TEST  [TESTPOINT]
TP33  WIFI_PWR  [TESTPOINT]  (value not drawn)
TP37  CFG  [TESTPOINT]  (value not drawn)
TP38  TX_PWR  [TESTPOINT]  (value not drawn)
TXD  TEST  [TESTPOINT]
U28  XTEND900  [XTEND900]
U31  TXB104PWR  [TSSOP14-L]
WPWR  TEST  [TESTPOINT]

### Ports
1V8 (in), 5V (in), GND (in), RX (in), TX (out), WIFI_POWER (in)

### Nets
1V8: C86.2 R63.2 U31.1(VccA) U31.8(OE) ; port 1V8
5V_SW: C81.2 C82.1 C84.1 C87.1 Q5#2.2(S) R61.2 U28.2(VCC) U31.14(VccB) WPWR.0(TP)
GND: C81.1 C82.2 C83.2 C84.2 C86.1 C87.2 Q6.2(S) R62#2.2 R63.1 U28.1(GND) U31.4(A3) U31.5(A4) U31.6(NC) U31.7(GND) U31.9(NC) U31.10(B4) U31.11(B3) ; port GND  [project net VREFN]
RXD: RXD.0(TP) U28.5(DI) U31.13(B1)
TXD: TXD.0(TP) U28.6(DO) U31.12(B2)
NetC83_1: C83.1 Q5#2.3(D) R56#2.2 ; port 5V
NetD12_A: D12.A U28.3(RX_LED/GPO2)
NetD12_K: D12.K R62#2.1
NetQ5#2_1: Q5#2.1(G) Q6.3(D) R56#2.1
NetQ6_1: Q6.1(G) R60.1
NetR60_2: R60.2 TP33.0(TP) ; port WIFI_POWER
NetR61_1: R61.1 U28.7(SHDN)
NetTP37_0: TP37.0(TP) U28.11(CONFIG/RSSI)
NetTP38_0: TP38.0(TP) U28.4(TX_PWR)
NetU31_2: U31.2(A1) ; port RX
NetU31_3: U31.3(A2) ; port TX

Not connected (* = marked no-connect by the designer): U28 8(SLEEP/GPI2) 9(CTS/RS485TX_EN/GPO1) 10(RTS/CMD/GPI1)

### Notes on the sheet
- (near R63) Logic Level Converter
- Title
- Size:
- Date:
- A4
- Number:
- Time:
- Revision:
- Sheet
- of
- File:
- (in symbol TXB0104PWR) 1V2-3V6; 1V65-5V5

### Library data of the parts
C81 C82 C84 C86 C87 = CAP: Capacitor
  C81: Digikey: 587-1441-1-ND; Farnell: 1688134; DigikeyPrice: 0.42; FarnellPrice: 0.585
C83 = CAP POL3: Polarized Capacitor (Surface Mount); Revision: July-2002: Re-released for DXP Platform.; Farnell: 1612292; FarnellPrice: 10.99; Digikey: 478-1787-1-ND; DigikeyPrice: 6.85
Q5#2 = IRLML5203PBF: MOSFET P-type SOT-23-3; Farnell: 9103511; FarnellPrice: 0.71
Q6 = ZXM61N02F: 1.7A, 20V N-Channel Enhancement mode FET; Digikey: ZXM61N02FCT-ND; DigikeyPrice: 0.66; Farnell: 9525270; FarnellPrice: 1.35
R56#2 R60 R61 R62#2 R63 = RES1: Resistor
RXD TP33 TP37 TP38 TXD WPWR = TEST: TEST POINT
U28 = XTEND900: Digi XTEND900 Radio Modem; Sparkfun: WRL-09411; SparkfunPrice: 184.95; Digikey: 3M1320-ND; DigikeyPrice: 2.02
U31 = TXB0104PWR: 4 bit bidirectional auto direction sense level translator; Digikey: 296-21929-1-ND; Farnell: 1607891; FarnellPrice: 3.1; DigikeyPrice: 1.93
D12 = LED: Farnell: *; Digikey: 475-1151-1-ND; DigikeyPrice: 0.28

## Sheet USB_Serial_Isolated.SchDoc: USB-Serial Isolated
size A4; Organization: UNSW Solar Racing Team; Address3: UNSW; Address4: Sydney NSW 2052; Address2: Electrical Engineering; Address1: Room 342
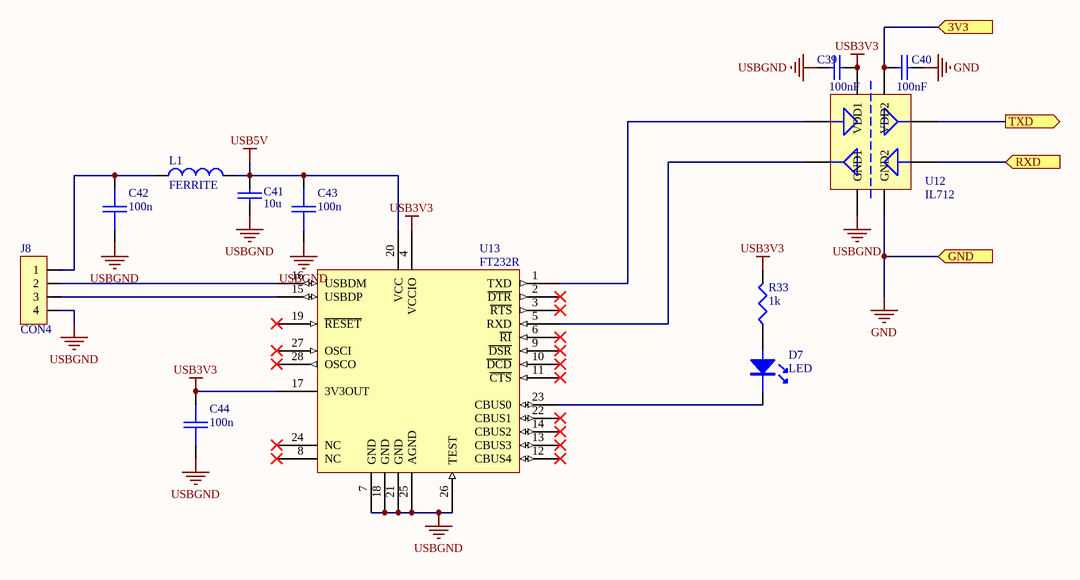
[diagram p7: USB_Serial_Isolated.SchDoc]

### Parts
(Parts that share a designator on the sheet are numbered #1, #2 ... from top to bottom, then left to right.)
C39#2  100nF  [0603]
C40#2  100nF  [0603]
C41#2  10u  [0805]
C42#2  100n  [0603]
C43#2  100n  [0603]
C44#2  100n  [0603]
D7  LED  [0805LED]
J8  CON4  [USB_B]
L1  FERRITE  [0805]
R33#2  1k  [0603]
U12#2  IL712  [SO8]
U13#2  FT232R  [SSOP28]

### Ports
3V3 (in), GND (in), RXD (in), TXD (out)

### Nets
GND: C40#2.2 U12#2.5(GND2) ; port GND  [project net VREFN]
USB3V3: C39#2.2 C44#2.1 R33#2.2 U12#2.1(VDD1) U13#2.4(VCCIO) U13#2.17(3V3OUT)
USB5V: C41#2.2 C43#2.1 L1.2 U13#2.20(VCC)
USBGND: C39#2.1 C41#2.1 C42#2.2 C43#2.2 C44#2.2 J8.4 U12#2.4(GND1) U13#2.7(GND) U13#2.18(GND) U13#2.21(GND) U13#2.25(AGND) U13#2.26(TEST)
NetC40#2_1: C40#2.1 U12#2.8(VDD2) ; port 3V3
NetC42#2_1: C42#2.1 J8.1 L1.1
NetD7_A: D7.A R33#2.1
NetD7_K: D7.K U13#2.23(CBUS0)
NetJ8_2: J8.2 U13#2.16(USBDM)
NetJ8_3: J8.3 U13#2.15(USBDP)
NetU12#2_2: U12#2.2(IN1) U13#2.1(TXD)
NetU12#2_3: U12#2.3(OUT2) U13#2.5(RXD)
NetU12#2_6: U12#2.6(IN2) ; port RXD
NetU12#2_7: U12#2.7(OUT1) ; port TXD

Not connected (* = marked no-connect by the designer): U13#2 2(~{DTR})* 3(~{RTS})* 6(~{RI})* 8(NC)* 9(~{DSR})* 10(~{DCD})* 11(~{CTS})* 12(CBUS4)* 13(CBUS3)* 14(CBUS2)* 19(~{RESET})* 22(CBUS1)* 24(NC)* 27(OSCI)* 28(OSCO)*

### Notes on the sheet
- Title
- Size:
- Date:
- A4
- Number:
- Time:
- Revision:
- Sheet
- of
- File:

### Library data of the parts
C39#2 C40#2 C41#2 C42#2 C43#2 C44#2 = CAP: Capacitor
  C39#2 C40#2 C42#2 C43#2 C44#2: Farnell: 753-567; Price: 0.31
  C41#2: Farnell: 521-2820; Price: 0.489
J8 = CON4: Connector; Farnell: 1258768; Price: 4.59
L1 = INDUCTOR: Manufacturer: Generic Components; Class I: Passive; Published: 8-Jun-2000; Revision: July-2002: Re-released for DXP Platform.; Publisher: Altium Limited; Class II: Inductor; Farnell: *; Value: *; Farnell: 323-7977; Price: 0.698
R33#2 = RES1: Resistor; Farnell: Stock
U12#2 = IL712: IL712 Optical Isolator
U13#2 = FT232R: USB UART IC; Farnell: 1146032; Cost: 9.98
D7 = LED: Farnell: *

## Nets that join several sheets
1V8: powertrain (C33.1 U12#1.5), wifi_isolated_uart (C86.2 R63.2 U31.1 U31.8)
CANGND: powertrain (6 pins), can_transciever_isolated (13 pins)
VDDA: toplevel (R12#1.1 R13#1.1 R14#1.1 U9.2), powertrain (5 pins), sepic (R27.1 TP5.0), can_transciever_isolated (C3.2 U2.16), LPC1768 (26 pins)
VREFN: toplevel (D6#1.1 U9.3), powertrain (11 pins), supercap (8 pins), sepic (26 pins), can_transciever_isolated (C3.1 U2.9 U2.15), LPC1768 (36 pins), wifi_isolated_uart (17 pins), USB_Serial_Isolated (C40#2.2 U12#2.5)
5V_ISO_V: powertrain (R21.1 TP11.0), supercap (U19.8), LPC1768 (U10.59)
5V_ISOLATED: powertrain (C30.1 D4.A U11.7), supercap (6 pins)
5V_REDUNDANT: powertrain (D4.K D5.K TP9.0), sepic (R26.2 TP6.0)
LTC4425_I: powertrain (C35.1 R22.1 TP12.0), LPC1768 (U10.20)
NetTP1_0: can_transciever_isolated (TP1.0 U2.14), LPC1768 (U10.57)
NetTP2_0: can_transciever_isolated (TP2.0 U2.13), LPC1768 (U10.66)
NetTP3_0: can_transciever_isolated (TP3.0 U2.12), LPC1768 (U10.56)
NetTP4_0: can_transciever_isolated (TP4.0 U2.11), LPC1768 (U10.65)
PROG: powertrain (R22.2), supercap (R34.1 R35.1 U19.3)
SUPERCAP_V: powertrain (C36.1 R24.2 R25.2), LPC1768 (U10.21)
VSUPERCAP: powertrain (D5.A R24.1 TP13.0), supercap (C55.1 R32.1 U19.1 U19.2)